# Altium schematic sheet I2C 1.SchDoc: I2C
size A4; Date: 04/19/2026; Author: Lanfroid-Nazac Guillaume; DrawnBy: Lanfroid-Nazac Guillaume; Revision: v1.0; SheetNumber: 6; SheetTotal: 7
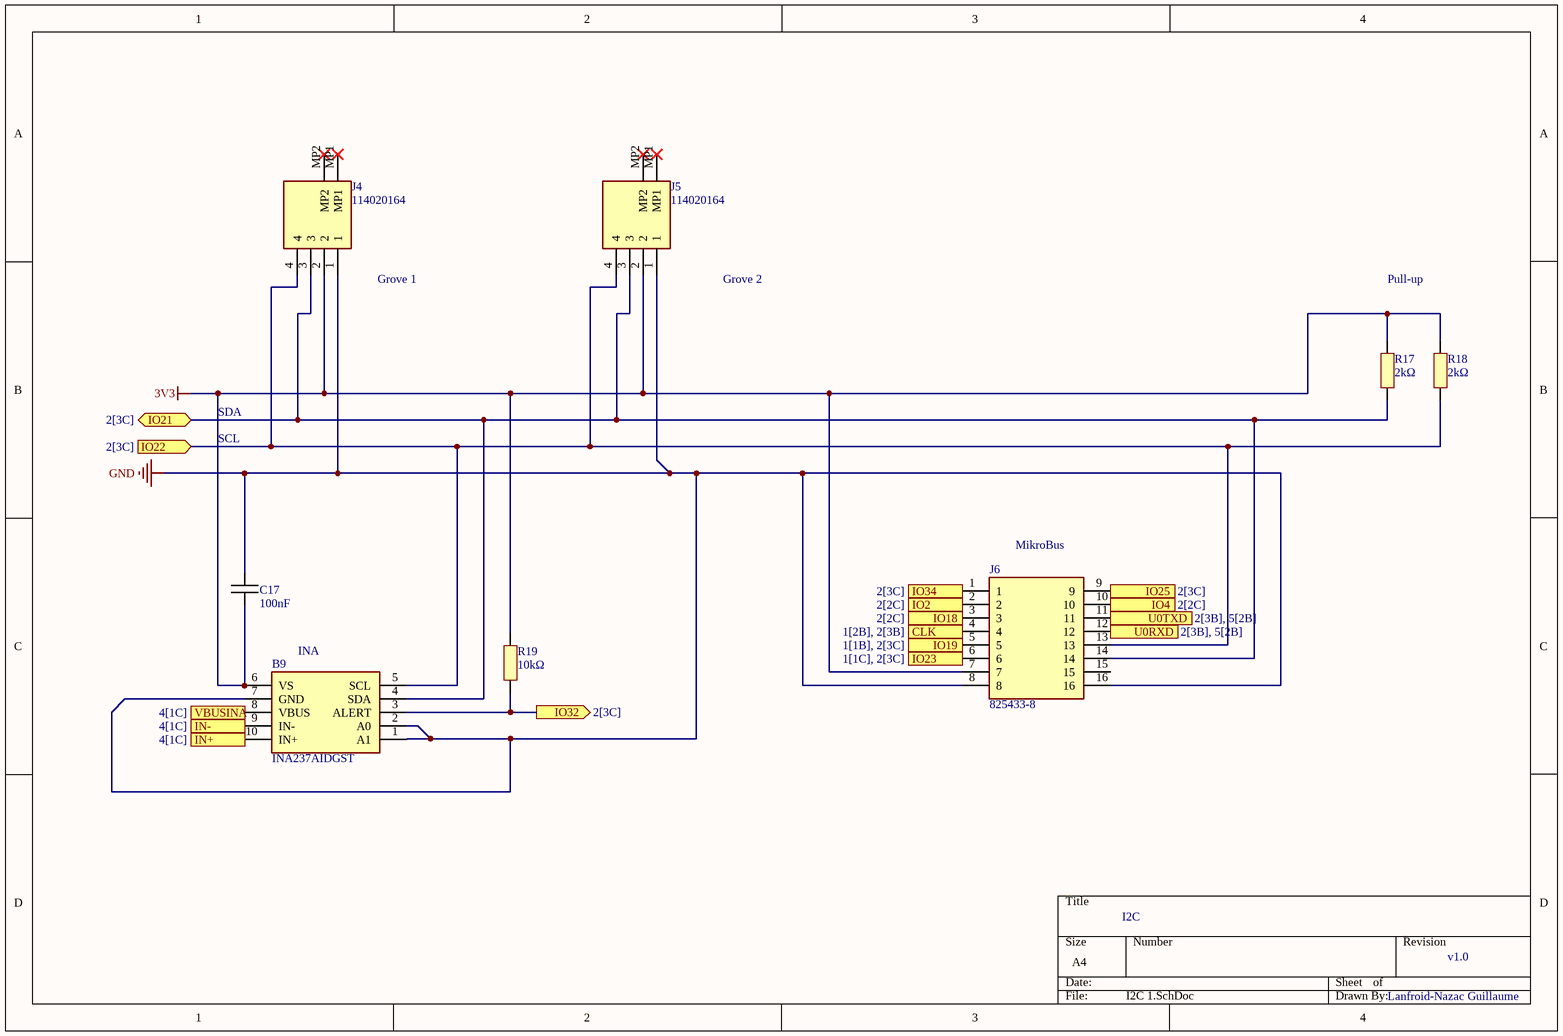
[diagram p0: I2C 1.SchDoc]

## Parts
B9  INA237AIDGST  [SOP50P490X110-10N]
C17  100nF  [CAPC1005X06N]
J4  114020164  [114020164]
J5  114020164  [114020164]
J6  825433-8  [Connect-Mikrobus]
R17  2kΩ  [RESC1005X06N]
R18  2kΩ  [RESC1005X06N]
R19  10kΩ  [RESC1005X06N]

## Ports
CLK (out, see 1[2B], 2[3B]), IN+ (in, see 4[1C]), IN- (in, see 4[1C]), IO2 (out, see 2[2C]), IO4 (in, see 2[2C]), IO18 (out, see 2[2C]), IO19 (out, see 1[1B], 2[3C]), IO21 (bidir, see 2[3C]), IO22 (in, see 2[3C]), IO23 (out, see 1[1C], 2[3C]), IO25 (out, see 2[3C]), IO32 (out, see 2[3C]), IO34 (in, see 2[3C]), U0RXD (out, see 2[3B], 5[2B]), U0TXD (out, see 2[3B], 5[2B]), VBUSINA (in, see 4[1C])

## Nets
3V3: B9.6(VS) C17.1 J4.2 J5.2 J6.7 R17.1 R18.1 R19.1
GND: B9.1(A1) B9.2(A0) B9.7(GND) C17.2 J4.1 J5.1 J6.8 J6.16
CLK: J6.4 ; port CLK
IN+: B9.10(IN+) ; port IN+
IN-: B9.9(IN-) ; port IN-
IO2: J6.2 ; port IO2
IO4: J6.10 ; port IO4
IO18: J6.3 ; port IO18
IO19: J6.5 ; port IO19
IO21: B9.4(SDA) J4.3 J5.3 J6.14 R17.2 ; port IO21
IO22: B9.5(SCL) J4.4 J5.4 J6.13 R18.2 ; port IO22
IO23: J6.6 ; port IO23
IO25: J6.9 ; port IO25
IO32: B9.3(ALERT) R19.2 ; port IO32
IO34: J6.1 ; port IO34
U0RXD: J6.12 ; port U0RXD
U0TXD: J6.11 ; port U0TXD
VBUSINA: B9.8(VBUS) ; port VBUSINA

Not connected (* = marked no-connect by the designer): J4 MP1* MP2*; J5 MP1* MP2*; J6 15

## Notes on the sheet
- (near J4) Grove 1
- Grove 2
- Pull-up
- SDA
- SCL
- (near J6) MikroBus
- (near B9) INA

## Library data of the parts
B9 = INA237AIDGST: Current Sense Amplifiers 85-V, 16-bit, I2C output current/voltage/power monitor with alert 10-VSSOP -40 to 125; Manufacturer_Name: Texas Instruments; Manufacturer_Part_Number: INA237AIDGST; Mouser Part Number: 595-INA237AIDGST
C17 = Capacitor
J4 J5 = 114020164: Seeed Studio Accessories Grove Female Header - SMD-4P-2.0mm-90D-20Pcs; Manufacturer_Name: Seeed Studio; Manufacturer_Part_Number: 114020164; Mouser Part Number: 713-114020164
J6 = Connect-Mikrobus: Headers & Wire Housings 8P double for connection mikrobus; Manufacturer_Name: TE Connectivity; Manufacturer_Part_Number: 825433-8; Mouser Part Number: 571-825433-8
R17-R19 = Resistor